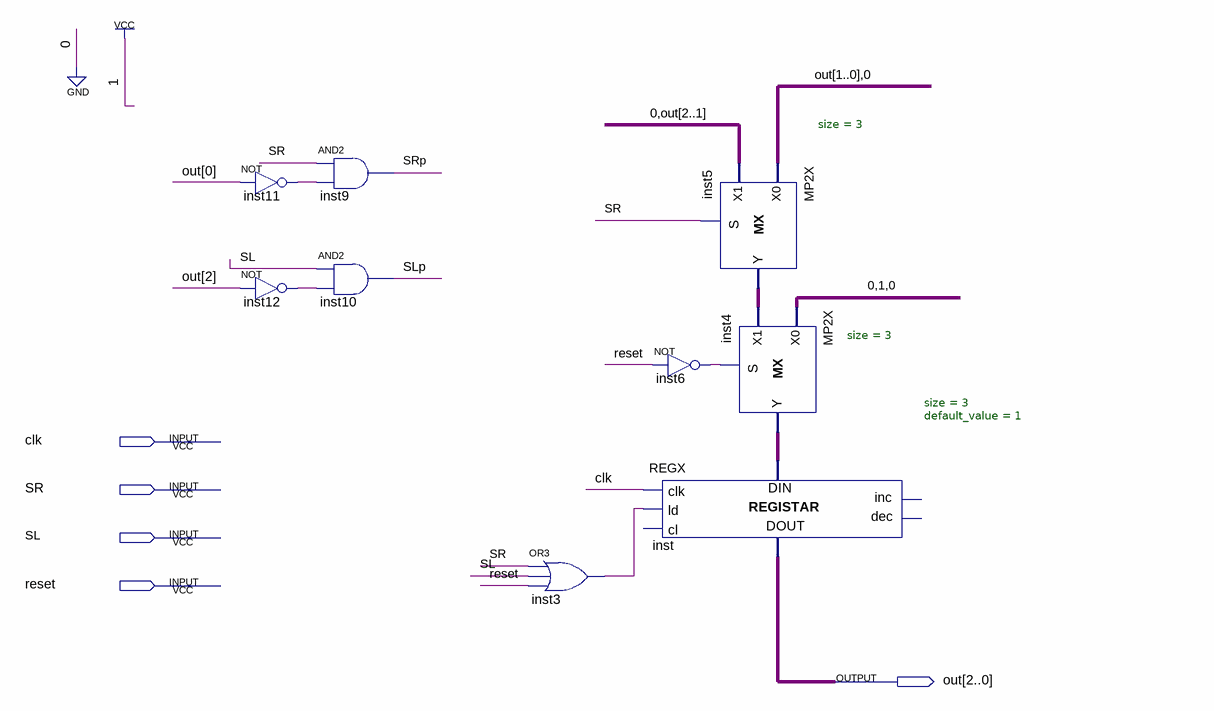
[diagram p0: schematic sheet]
// Quartus schematic REG_shift.bdf as structural Verilog: 9 symbols, 5 pins
module REG_shift (
  input  clk,
  input  SR,
  input  SL,
  input  reset,
  output [2:0] out
);

  wire inst3_out, inst6_out, inst11_out, inst12_out, SLp, SRp;
  wire [2:0] inst4_y, inst5_y;

  not inst11 (inst11_out, out[0]);
  not inst12 (inst12_out, out[2]);
  and inst9 (SRp, SR, inst11_out);
  and inst10 (SLp, SL, inst12_out);
  or inst3 (inst3_out, SR, SL, reset);
  not inst6 (inst6_out, reset);
  REGX #(.size(3), .default_value(1)) inst (
    .clk(clk), .ld(inst3_out), .data_in(inst4_y), .data_out(out));  // open: cl, inc, dec
  MP2X #(.size(3)) inst5 (.S(SR), .X0({out[1:0], 1'b0}), .X1({1'b0, out[2:1]}), .Y(inst5_y));
  MP2X #(.size(3)) inst4 (.S(inst6_out), .X0(3'b010), .X1(inst5_y), .Y(inst4_y));
endmodule
